# EAGLE design Nein (EAGLE 7.7.0)
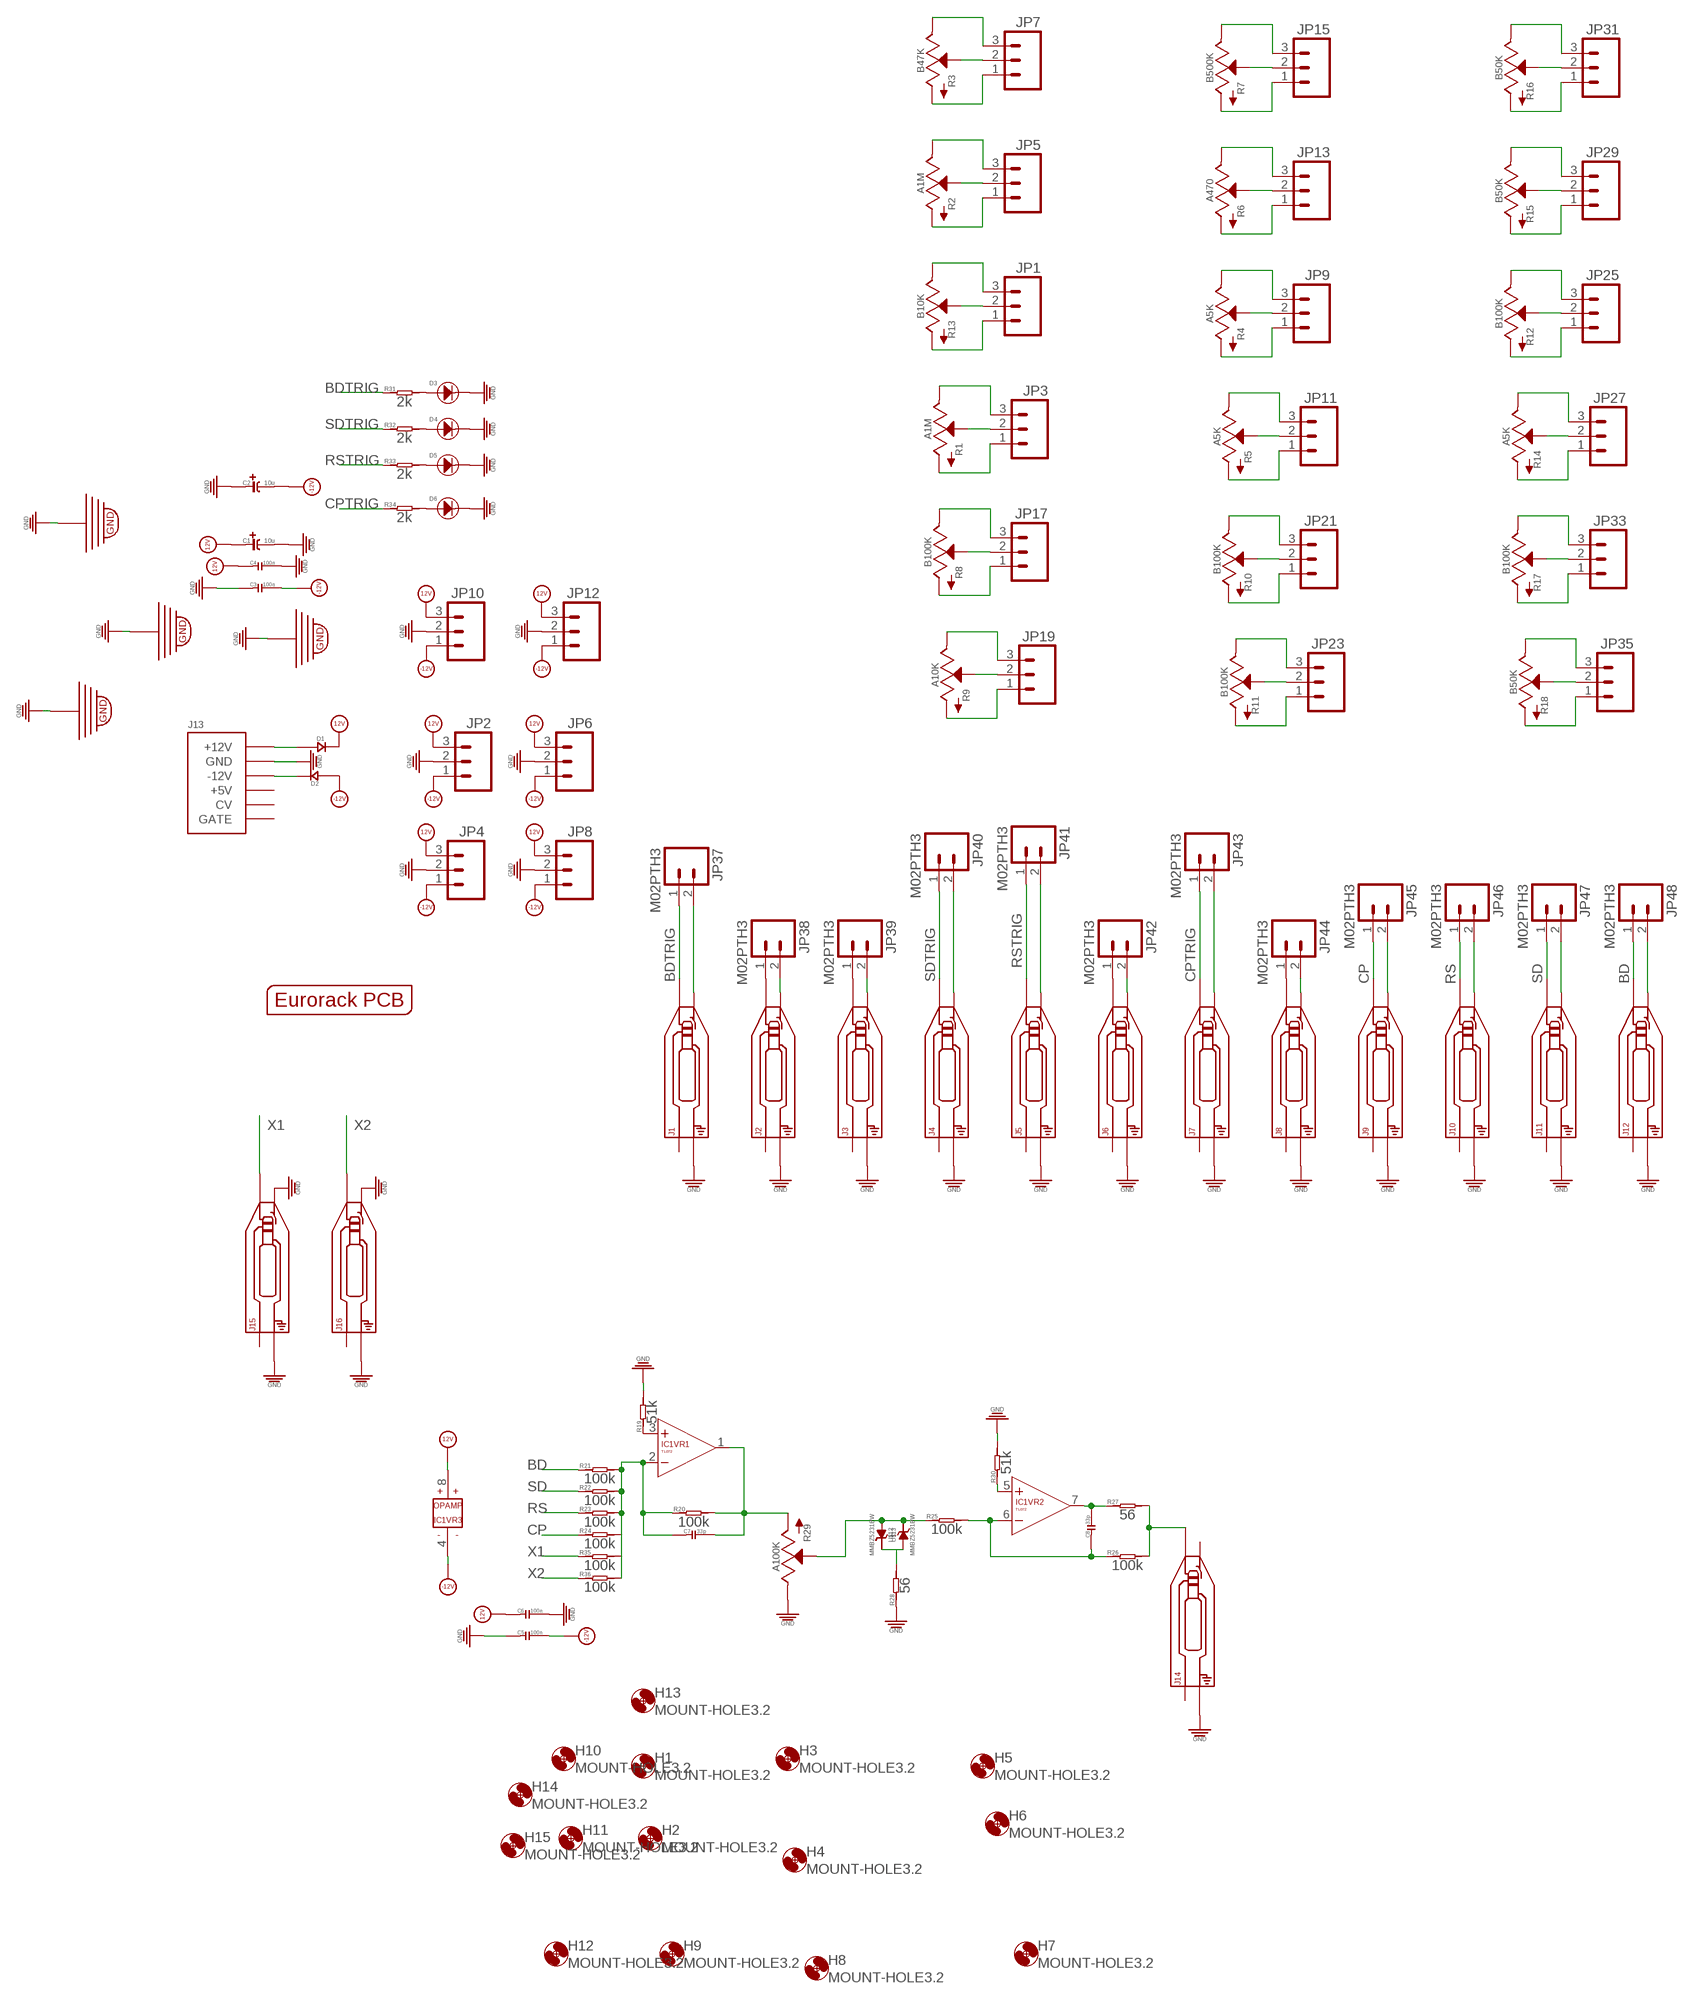
[diagram p0: schematic, sheet 1]

## Parts
C1  10u  C-POLAR-A  [CASE-A_3216]
C2  10u  C-POLAR-A  [CASE-A_3216]
C3  100n  C-0603  [C0603]
C4  100n  C-0603  [C0603]
C5  100n  C-0603  [C0603]
C6  100n  C-0603  [C0603]
C7  33p  C-0603  [C0603]
C8  33p  C-0603  [C0603]
D1  D-SMA  [DO-214AC]
D2  D-SMA  [DO-214AC]
D3  LED3MM  [3MMLED]
D4  LED3MM  [3MMLED]
D5  LED3MM  [3MMLED]
D6  LED3MM  [3MMLED]
H1  MOUNT-HOLE3.2  [3,2]
H2  MOUNT-HOLE3.2  [3,2]
H3  MOUNT-HOLE3.2  [3,2]
H4  MOUNT-HOLE3.2  [3,2]
H5  MOUNT-HOLE3.2  [3,2]
H6  MOUNT-HOLE3.2  [3,2]
H7  MOUNT-HOLE3.2  [3,2]
H8  MOUNT-HOLE3.2  [3,2]
H9  MOUNT-HOLE3.2  [3,2]
H10  MOUNT-HOLE3.2  [3,2]
H11  MOUNT-HOLE3.2  [3,2]
H12  MOUNT-HOLE3.2  [3,2]
H13  MOUNT-HOLE3.2  [3,2]
H14  MOUNT-HOLE3.2  [3,2]
H15  MOUNT-HOLE3.2  [3,2]
IC1  TL072  [SO08]
J1  AUDIO-JACK_SMALLSYMBOLNODRILL  [3.5MM-JACK-SWITCH-13MM-NOHOLES]
J2  AUDIO-JACK_SMALLSYMBOLNODRILL  [3.5MM-JACK-SWITCH-13MM-NOHOLES]
J3  AUDIO-JACK_SMALLSYMBOLNODRILL  [3.5MM-JACK-SWITCH-13MM-NOHOLES]
J4  AUDIO-JACK_SMALLSYMBOLNODRILL  [3.5MM-JACK-SWITCH-13MM-NOHOLES]
J5  AUDIO-JACK_SMALLSYMBOLNODRILL  [3.5MM-JACK-SWITCH-13MM-NOHOLES]
J6  AUDIO-JACK_SMALLSYMBOLNODRILL  [3.5MM-JACK-SWITCH-13MM-NOHOLES]
J7  AUDIO-JACK_SMALLSYMBOLNODRILL  [3.5MM-JACK-SWITCH-13MM-NOHOLES]
J8  AUDIO-JACK_SMALLSYMBOLNODRILL  [3.5MM-JACK-SWITCH-13MM-NOHOLES]
J9  AUDIO-JACK_SMALLSYMBOLNODRILL  [3.5MM-JACK-SWITCH-13MM-NOHOLES]
J10  AUDIO-JACK_SMALLSYMBOLNODRILL  [3.5MM-JACK-SWITCH-13MM-NOHOLES]
J11  AUDIO-JACK_SMALLSYMBOLNODRILL  [3.5MM-JACK-SWITCH-13MM-NOHOLES]
J12  AUDIO-JACK_SMALLSYMBOLNODRILL  [3.5MM-JACK-SWITCH-13MM-NOHOLES]
J13  POWERSHROUDED  [POWER_16_SHROUDED]
J14  AUDIO-JACK_SMALLSYMBOLNODRILL  [3.5MM-JACK-SWITCH-13MM-NOHOLES]
J15  AUDIO-JACK_SMALLSYMBOLNODRILL  [3.5MM-JACK-SWITCH-13MM-NOHOLES]
J16  AUDIO-JACK_SMALLSYMBOLNODRILL  [3.5MM-JACK-SWITCH-13MM-NOHOLES]
JP1  M03LONGPADS  [1X03_LONGPADS]
JP2  M03LONGPADS  [1X03_LONGPADS]
JP3  M03LONGPADS  [1X03_LONGPADS]
JP4  M03LONGPADS  [1X03_LONGPADS]
JP5  M03LONGPADS  [1X03_LONGPADS]
JP6  M03LONGPADS  [1X03_LONGPADS]
JP7  M03LONGPADS  [1X03_LONGPADS]
JP8  M03LONGPADS  [1X03_LONGPADS]
JP9  M03LONGPADS  [1X03_LONGPADS]
JP10  M03LONGPADS  [1X03_LONGPADS]
JP11  M03LONGPADS  [1X03_LONGPADS]
JP12  M03LONGPADS  [1X03_LONGPADS]
JP13  M03LONGPADS  [1X03_LONGPADS]
JP15  M03LONGPADS  [1X03_LONGPADS]
JP17  M03LONGPADS  [1X03_LONGPADS]
JP19  M03LONGPADS  [1X03_LONGPADS]
JP21  M03LONGPADS  [1X03_LONGPADS]
JP23  M03LONGPADS  [1X03_LONGPADS]
JP25  M03LONGPADS  [1X03_LONGPADS]
JP27  M03LONGPADS  [1X03_LONGPADS]
JP29  M03LONGPADS  [1X03_LONGPADS]
JP31  M03LONGPADS  [1X03_LONGPADS]
JP33  M03LONGPADS  [1X03_LONGPADS]
JP35  M03LONGPADS  [1X03_LONGPADS]
JP37  M02PTH3  [1X02_LONGPADS]
JP38  M02PTH3  [1X02_LONGPADS]
JP39  M02PTH3  [1X02_LONGPADS]
JP40  M02PTH3  [1X02_LONGPADS]
JP41  M02PTH3  [1X02_LONGPADS]
JP42  M02PTH3  [1X02_LONGPADS]
JP43  M02PTH3  [1X02_LONGPADS]
JP44  M02PTH3  [1X02_LONGPADS]
JP45  M02PTH3  [1X02_LONGPADS]
JP46  M02PTH3  [1X02_LONGPADS]
JP47  M02PTH3  [1X02_LONGPADS]
JP48  M02PTH3  [1X02_LONGPADS]
PCB1  EURORACK_PCB36HP_10CM  [EURORACK36HP]
R1  A1M  POTSQUAREHOLE_SMALLKNOB  [ALPS_POT_SQUAREHOLES]
R2  A1M  POTSQUAREHOLE_SMALLKNOB  [ALPS_POT_SQUAREHOLES]
R3  B47K  POTSQUAREHOLE_SMALLKNOB  [ALPS_POT_SQUAREHOLES]
R4  A5K  POTSQUAREHOLE_SMALLKNOB  [ALPS_POT_SQUAREHOLES]
R5  A5K  POTSQUAREHOLE_SMALLKNOB  [ALPS_POT_SQUAREHOLES]
R6  A470  POTSQUAREHOLE_SMALLKNOB  [ALPS_POT_SQUAREHOLES]
R7  B500K  POTSQUAREHOLE_SMALLKNOB  [ALPS_POT_SQUAREHOLES]
R8  B100K  POTSQUAREHOLE_SMALLKNOB  [ALPS_POT_SQUAREHOLES]
R9  A10K  POTSQUAREHOLE_SMALLKNOB  [ALPS_POT_SQUAREHOLES]
R10  B100K  POTSQUAREHOLE_SMALLKNOB  [ALPS_POT_SQUAREHOLES]
R11  B100K  POTSQUAREHOLE_SMALLKNOB  [ALPS_POT_SQUAREHOLES]
R12  B100K  POTSQUAREHOLE_SMALLKNOB  [ALPS_POT_SQUAREHOLES]
R13  B10K  POTSQUAREHOLE_SMALLKNOB  [ALPS_POT_SQUAREHOLES]
R14  A5K  POTSQUAREHOLE_SMALLKNOB  [ALPS_POT_SQUAREHOLES]
R15  B50K  POTSQUAREHOLE_SMALLKNOB  [ALPS_POT_SQUAREHOLES]
R16  B50K  POTSQUAREHOLE_SMALLKNOB  [ALPS_POT_SQUAREHOLES]
R17  B100K  POTSQUAREHOLE_SMALLKNOB  [ALPS_POT_SQUAREHOLES]
R18  B50K  POTSQUAREHOLE_SMALLKNOB  [ALPS_POT_SQUAREHOLES]
R19  51k  R-0603  [R0603]
R20  100k  R-0603  [R0603]
R21  100k  R-0603  [R0603]
R22  100k  R-0603  [R0603]
R23  100k  R-0603  [R0603]
R24  100k  R-0603  [R0603]
R25  100k  R-0603  [R0603]
R26  100k  R-0603  [R0603]
R27  56  R-0603  [R0603]
R28  56  R-0603  [R0603]
R29  A100K  POTSQUAREHOLE_SMALLKNOB  [ALPS_POT_SQUAREHOLES]
R30  51k  R-0603  [R0603]
R31  2k  R-0603  [R0603]
R32  2k  R-0603  [R0603]
R33  2k  R-0603  [R0603]
R34  2k  R-0603  [R0603]
R35  100k  R-0603  [R0603]
R36  100k  R-0603  [R0603]
U$4  GNDLOOP  [GROUNDLOOP]
U$12  MMBZ5231BW  [SOT-323-ZENER]
U$13  MMBZ5231BW  [SOT-323-ZENER]
U$26  GNDLOOP  [GROUNDLOOP]
U$27  GNDLOOP  [GROUNDLOOP]
U$28  GNDLOOP  [GROUNDLOOP]

## Nets
12V [power]: C1.+ C4.1 C6.1 D1.2(-) IC1.8(VR3:V+) JP2.3 JP4.3 JP6.3 JP8.3 JP10.3 JP12.3
-12V [power]: C2.- C3.2 C5.2 D2.1(+) IC1.4(VR3:V-) JP2.1 JP4.1 JP6.1 JP8.1 JP10.1 JP12.1
BD: J12.TIP_B@1(TIP) J12.TIP_T@3(TIP) JP48.1 R21.1
BDTRIG: J1.TIP_B@1(TIP) J1.TIP_T@3(TIP) JP37.1 R31.1
CP: J9.TIP_B@1(TIP) J9.TIP_T@3(TIP) JP45.1 R24.1
CPTRIG: J7.TIP_B@1(TIP) J7.TIP_T@3(TIP) JP43.1 R34.1
GND [power]: C1.- C2.+ C3.1 C4.2 C5.1 C6.2 D3.- D4.- D5.- D6.- J1.RING_B@1(RING) J1.RING_T@3(RING) J2.RING_B@1(RING) J2.RING_T@3(RING) J3.RING_B@1(RING) J3.RING_T@3(RING) J4.RING_B@1(RING) J4.RING_T@3(RING) J5.RING_B@1(RING) J5.RING_T@3(RING) J6.RING_B@1(RING) J6.RING_T@3(RING) J7.RING_B@1(RING) J7.RING_T@3(RING) J8.RING_B@1(RING) J8.RING_T@3(RING) J9.RING_B@1(RING) J9.RING_T@3(RING) J10.RING_B@1(RING) J10.RING_T@3(RING) J11.RING_B@1(RING) J11.RING_T@3(RING) J12.RING_B@1(RING) J12.RING_T@3(RING) J13.3(GND) J13.4(GND) J13.5(GND) J13.6(GND) J13.7(GND) J13.8(GND) J14.RING_B@1(RING) J14.RING_T@3(RING) J15.RING_B@1(RING) J15.RING_T@3(RING) J15.SWITCH_B@1(SWITCH) J15.SWITCH_T@3(SWITCH) J16.RING_B@1(RING) J16.RING_T@3(RING) J16.SWITCH_B@1(SWITCH) J16.SWITCH_T@3(SWITCH) JP2.2 JP4.2 JP6.2 JP8.2 JP10.2 JP12.2 R19.2 R28.1 R29.P$1(E) R30.2 U$4.P$1 U$4.P$2 U$26.P$1 U$26.P$2 U$27.P$1 U$27.P$2 U$28.P$1 U$28.P$2
N$1 [power]: D1.1(+) J13.9(+12V) J13.10(+12V)
N$2 [power]: D2.2(-) J13.1(-12V) J13.2(-12V)
N$3: JP1.2 R13.P$2(S)
N$4: JP1.3 R13.P$1(E)
N$5: JP1.1 R13.P$3(A)
N$6: JP3.2 R1.P$2(S)
N$7: JP3.3 R1.P$1(E)
N$8: JP3.1 R1.P$3(A)
N$9: JP5.2 R2.P$2(S)
N$10: JP5.3 R2.P$1(E)
N$11: JP5.1 R2.P$3(A)
N$12: JP7.2 R3.P$2(S)
N$13: JP7.3 R3.P$1(E)
N$14: JP7.1 R3.P$3(A)
N$15: JP9.2 R4.P$2(S)
N$16: JP9.3 R4.P$1(E)
N$17: JP9.1 R4.P$3(A)
N$18: JP11.2 R5.P$2(S)
N$19: JP11.3 R5.P$1(E)
N$20: JP11.1 R5.P$3(A)
N$21: JP13.2 R6.P$2(S)
N$22: JP13.3 R6.P$1(E)
N$23: JP13.1 R6.P$3(A)
N$24: JP15.2 R7.P$2(S)
N$25: JP15.3 R7.P$1(E)
N$26: JP15.1 R7.P$3(A)
N$27: JP17.2 R8.P$2(S)
N$28: JP17.3 R8.P$1(E)
N$29: JP17.1 R8.P$3(A)
N$30: JP19.2 R9.P$2(S)
N$31: JP19.3 R9.P$1(E)
N$32: JP19.1 R9.P$3(A)
N$33: JP21.2 R10.P$2(S)
N$34: JP21.3 R10.P$1(E)
N$35: JP21.1 R10.P$3(A)
N$36: JP23.2 R11.P$2(S)
N$37: JP23.3 R11.P$1(E)
N$38: JP23.1 R11.P$3(A)
N$39: JP25.2 R12.P$2(S)
N$40: JP25.3 R12.P$1(E)
N$41: JP25.1 R12.P$3(A)
N$42: JP27.2 R14.P$2(S)
N$43: JP27.3 R14.P$1(E)
N$44: JP27.1 R14.P$3(A)
N$45: JP29.2 R15.P$2(S)
N$46: JP29.3 R15.P$1(E)
N$47: JP29.1 R15.P$3(A)
N$48: JP31.2 R16.P$2(S)
N$49: JP31.3 R16.P$1(E)
N$50: JP31.1 R16.P$3(A)
N$51: JP33.2 R17.P$2(S)
N$52: JP33.3 R17.P$1(E)
N$53: JP33.1 R17.P$3(A)
N$54: JP35.2 R18.P$2(S)
N$55: JP35.3 R18.P$1(E)
N$56: JP35.1 R18.P$3(A)
N$58: J1.SWITCH_B@1(SWITCH) J1.SWITCH_T@3(SWITCH) JP37.2
N$59: J2.TIP_B@1(TIP) J2.TIP_T@3(TIP) JP38.1
N$60: J2.SWITCH_B@1(SWITCH) J2.SWITCH_T@3(SWITCH) JP38.2
N$61: J3.TIP_B@1(TIP) J3.TIP_T@3(TIP) JP39.1
N$62: J3.SWITCH_B@1(SWITCH) J3.SWITCH_T@3(SWITCH) JP39.2
N$64: J4.SWITCH_B@1(SWITCH) J4.SWITCH_T@3(SWITCH) JP40.2
N$66: J5.SWITCH_B@1(SWITCH) J5.SWITCH_T@3(SWITCH) JP41.2
N$67: J6.TIP_B@1(TIP) J6.TIP_T@3(TIP) JP42.1
N$68: J6.SWITCH_B@1(SWITCH) J6.SWITCH_T@3(SWITCH) JP42.2
N$70: J7.SWITCH_B@1(SWITCH) J7.SWITCH_T@3(SWITCH) JP43.2
N$71: J8.TIP_B@1(TIP) J8.TIP_T@3(TIP) JP44.1
N$72: J8.SWITCH_B@1(SWITCH) J8.SWITCH_T@3(SWITCH) JP44.2
N$73: IC1.3(VR1:+IN) R19.1
N$74: J9.SWITCH_B@1(SWITCH) J9.SWITCH_T@3(SWITCH) JP45.2
N$75: IC1.5(VR2:+IN) R30.1
N$76: J10.SWITCH_B@1(SWITCH) J10.SWITCH_T@3(SWITCH) JP46.2
N$77: D3.+ R31.2
N$78: J11.SWITCH_B@1(SWITCH) J11.SWITCH_T@3(SWITCH) JP47.2
N$79: D4.+ R32.2
N$80: J12.SWITCH_B@1(SWITCH) J12.SWITCH_T@3(SWITCH) JP48.2
N$81: D5.+ R33.2
N$82: D6.+ R34.2
N$84: C7.1 IC1.2(VR1:-IN) R20.1 R21.2 R22.2 R23.2 R24.2 R35.2 R36.2
N$85: R28.2 U$12.CATHODE U$13.ANODE
N$86: C7.2 IC1.1(VR1:OUT) R20.2 R29.P$3(A)
N$87: C8.1 IC1.6(VR2:-IN) R25.2 R26.1
N$88: C8.2 IC1.7(VR2:OUT) R27.1
N$89: J14.TIP_B@1(TIP) J14.TIP_T@3(TIP) R26.2 R27.2
N$90: R25.1 R29.P$2(S) U$12.ANODE U$13.CATHODE
RS: J10.TIP_B@1(TIP) J10.TIP_T@3(TIP) JP46.1 R23.1
RSTRIG: J5.TIP_B@1(TIP) J5.TIP_T@3(TIP) JP41.1 R33.1
SD: J11.TIP_B@1(TIP) J11.TIP_T@3(TIP) JP47.1 R22.1
SDTRIG: J4.TIP_B@1(TIP) J4.TIP_T@3(TIP) JP40.1 R32.1
X1: J15.TIP_B@1(TIP) J15.TIP_T@3(TIP) R35.1
X2: J16.TIP_B@1(TIP) J16.TIP_T@3(TIP) R36.1
Unconnected: J1.SECOND_B@1(SECOND) J1.SECOND_T@3(SECOND) J2.SECOND_B@1(SECOND) J2.SECOND_T@3(SECOND) J3.SECOND_B@1(SECOND) J3.SECOND_T@3(SECOND) J4.SECOND_B@1(SECOND) J4.SECOND_T@3(SECOND) J5.SECOND_B@1(SECOND) J5.SECOND_T@3(SECOND) J6.SECOND_B@1(SECOND) J6.SECOND_T@3(SECOND) J7.SECOND_B@1(SECOND) J7.SECOND_T@3(SECOND) J8.SECOND_B@1(SECOND) J8.SECOND_T@3(SECOND) J9.SECOND_B@1(SECOND) J9.SECOND_T@3(SECOND) J10.SECOND_B@1(SECOND) J10.SECOND_T@3(SECOND) J11.SECOND_B@1(SECOND) J11.SECOND_T@3(SECOND) J12.SECOND_B@1(SECOND) J12.SECOND_T@3(SECOND) J13.11(+5V) J13.12(+5V) J13.13(CV) J13.14(CV) J13.15(GATE) J13.16(GATE) J14.SECOND_B@1(SECOND) J14.SECOND_T@3(SECOND) J14.SWITCH_B@1(SWITCH) J14.SWITCH_T@3(SWITCH) J15.SECOND_B@1(SECOND) J15.SECOND_T@3(SECOND) J16.SECOND_B@1(SECOND) J16.SECOND_T@3(SECOND)

## Library data of the parts
C1 C2 = EurorackModularParts:C-POLAR*
C3-C8 = OPL:C*
D1 D2 = OPL:D*: DIODE
D3-D6 = EurorackModularParts:LED*: LED
H1-H15 = zephod-components:MOUNT-HOLE: MOUNTING HOLE with drill center marker
IC1 = EurorackModularParts:TL072
J1 = EurorackModularParts:AUDIO-JACK_SMALLSYMBOL: Switching Mono 3.5mm Audio Jack from Erthenvar.; DESC: BD Trig
J2 = EurorackModularParts:AUDIO-JACK_SMALLSYMBOL: Switching Mono 3.5mm Audio Jack from Erthenvar.; DESC: BD Acc
J3 = EurorackModularParts:AUDIO-JACK_SMALLSYMBOL: Switching Mono 3.5mm Audio Jack from Erthenvar.; DESC: SD Acc
J4 = EurorackModularParts:AUDIO-JACK_SMALLSYMBOL: Switching Mono 3.5mm Audio Jack from Erthenvar.; DESC: SD Trig
J5 = EurorackModularParts:AUDIO-JACK_SMALLSYMBOL: Switching Mono 3.5mm Audio Jack from Erthenvar.; DESC: RS Trig
J6 = EurorackModularParts:AUDIO-JACK_SMALLSYMBOL: Switching Mono 3.5mm Audio Jack from Erthenvar.; DESC: RS Acc
J7 = EurorackModularParts:AUDIO-JACK_SMALLSYMBOL: Switching Mono 3.5mm Audio Jack from Erthenvar.; DESC: CP Trig
J8 = EurorackModularParts:AUDIO-JACK_SMALLSYMBOL: Switching Mono 3.5mm Audio Jack from Erthenvar.; DESC: CP Acc
J9 = EurorackModularParts:AUDIO-JACK_SMALLSYMBOL: Switching Mono 3.5mm Audio Jack from Erthenvar.; DESC: CP Out
J10 = EurorackModularParts:AUDIO-JACK_SMALLSYMBOL: Switching Mono 3.5mm Audio Jack from Erthenvar.; DESC: RS Out
J11 = EurorackModularParts:AUDIO-JACK_SMALLSYMBOL: Switching Mono 3.5mm Audio Jack from Erthenvar.; DESC: SD Out
J12 = EurorackModularParts:AUDIO-JACK_SMALLSYMBOL: Switching Mono 3.5mm Audio Jack from Erthenvar.; DESC: BD Out
J13 = EurorackModularParts:POWER
J14 = EurorackModularParts:AUDIO-JACK_SMALLSYMBOL: Switching Mono 3.5mm Audio Jack from Erthenvar.; DESC: Mix Out
J15 = EurorackModularParts:AUDIO-JACK_SMALLSYMBOL: Switching Mono 3.5mm Audio Jack from Erthenvar.; DESC: Mix 1
J16 = EurorackModularParts:AUDIO-JACK_SMALLSYMBOL: Switching Mono 3.5mm Audio Jack from Erthenvar.; DESC: Mix 2
JP1-JP13 JP15 JP17 JP19 JP21 JP23 JP25 JP27 JP29 JP31 JP33 JP35 = SparkFun-Connectors:M03: Header 3 Standard 3-pin 0.1" header. Use with straight break away headers (SKU : PRT-00116), right angle break away headers (PRT-00553), swiss pins (PRT-00743), machine pins (PRT-00117), and female headers (PRT-00115). Molex polarized connector foot print use with SKU : PRT-08232 with associated crimp pins and housings.
JP37-JP48 = SparkFun-Connectors:M02: Standard 2-pin 0.1" header. Use with - straight break away headers ( PRT-00116) - right angle break away headers (PRT-00553) - swiss pins (PRT-00743) - machine pins (PRT-00117) - female headers (PRT-00115) Molex polarized connector foot print use with: PRT-08233 with associated crimp pins and housings. 2.54_SCREWTERM for use with PRT-10571. 3.5mm Screw Terminal footprints for PRT-08084 5mm Screw Terminal footprints for use with PRT-08433
PCB1 = EurorackModularParts:EURORACK_PCB
R1 = EurorackModularParts:POT; DESC: BD Decay
R2 = EurorackModularParts:POT; DESC: BD Tune Decay
R3 = EurorackModularParts:POT; DESC: BD Pitch
R4 = EurorackModularParts:POT; DESC: RS Tune 2
R5 = EurorackModularParts:POT; DESC: RS Tune 1
R6 = EurorackModularParts:POT; DESC: BD Attack
R7 = EurorackModularParts:POT; DESC: SD Tune 2
R8 = EurorackModularParts:POT; DESC: CP Noise 1
R9 = EurorackModularParts:POT; DESC: BD Distort
R10 = EurorackModularParts:POT; DESC: SD Snap
R11 = EurorackModularParts:POT; DESC: CP Noise 2
R12 = EurorackModularParts:POT; DESC: RS Level
R13 = EurorackModularParts:POT; DESC: SD Tune 1
R14 = EurorackModularParts:POT; DESC: RS Tune 3
R15 = EurorackModularParts:POT; DESC: CP Level
R16 = EurorackModularParts:POT; DESC: SD Level
R17 = EurorackModularParts:POT; DESC: BD Level
R18 = EurorackModularParts:POT; DESC: CP Intensity
R19-R28 R30-R36 = OPL:R*
R29 = EurorackModularParts:POT; DESC: Mix Level
U$4 U$26-U$28 = FenixBase:GNDLOOP
U$12 U$13 = FenixBase:MMBZ5231BW: 5.1V ZENER DIODE - SMD

## Net classes
0 default: width 0.254 mm
1 power: width 0.635 mm

## Board
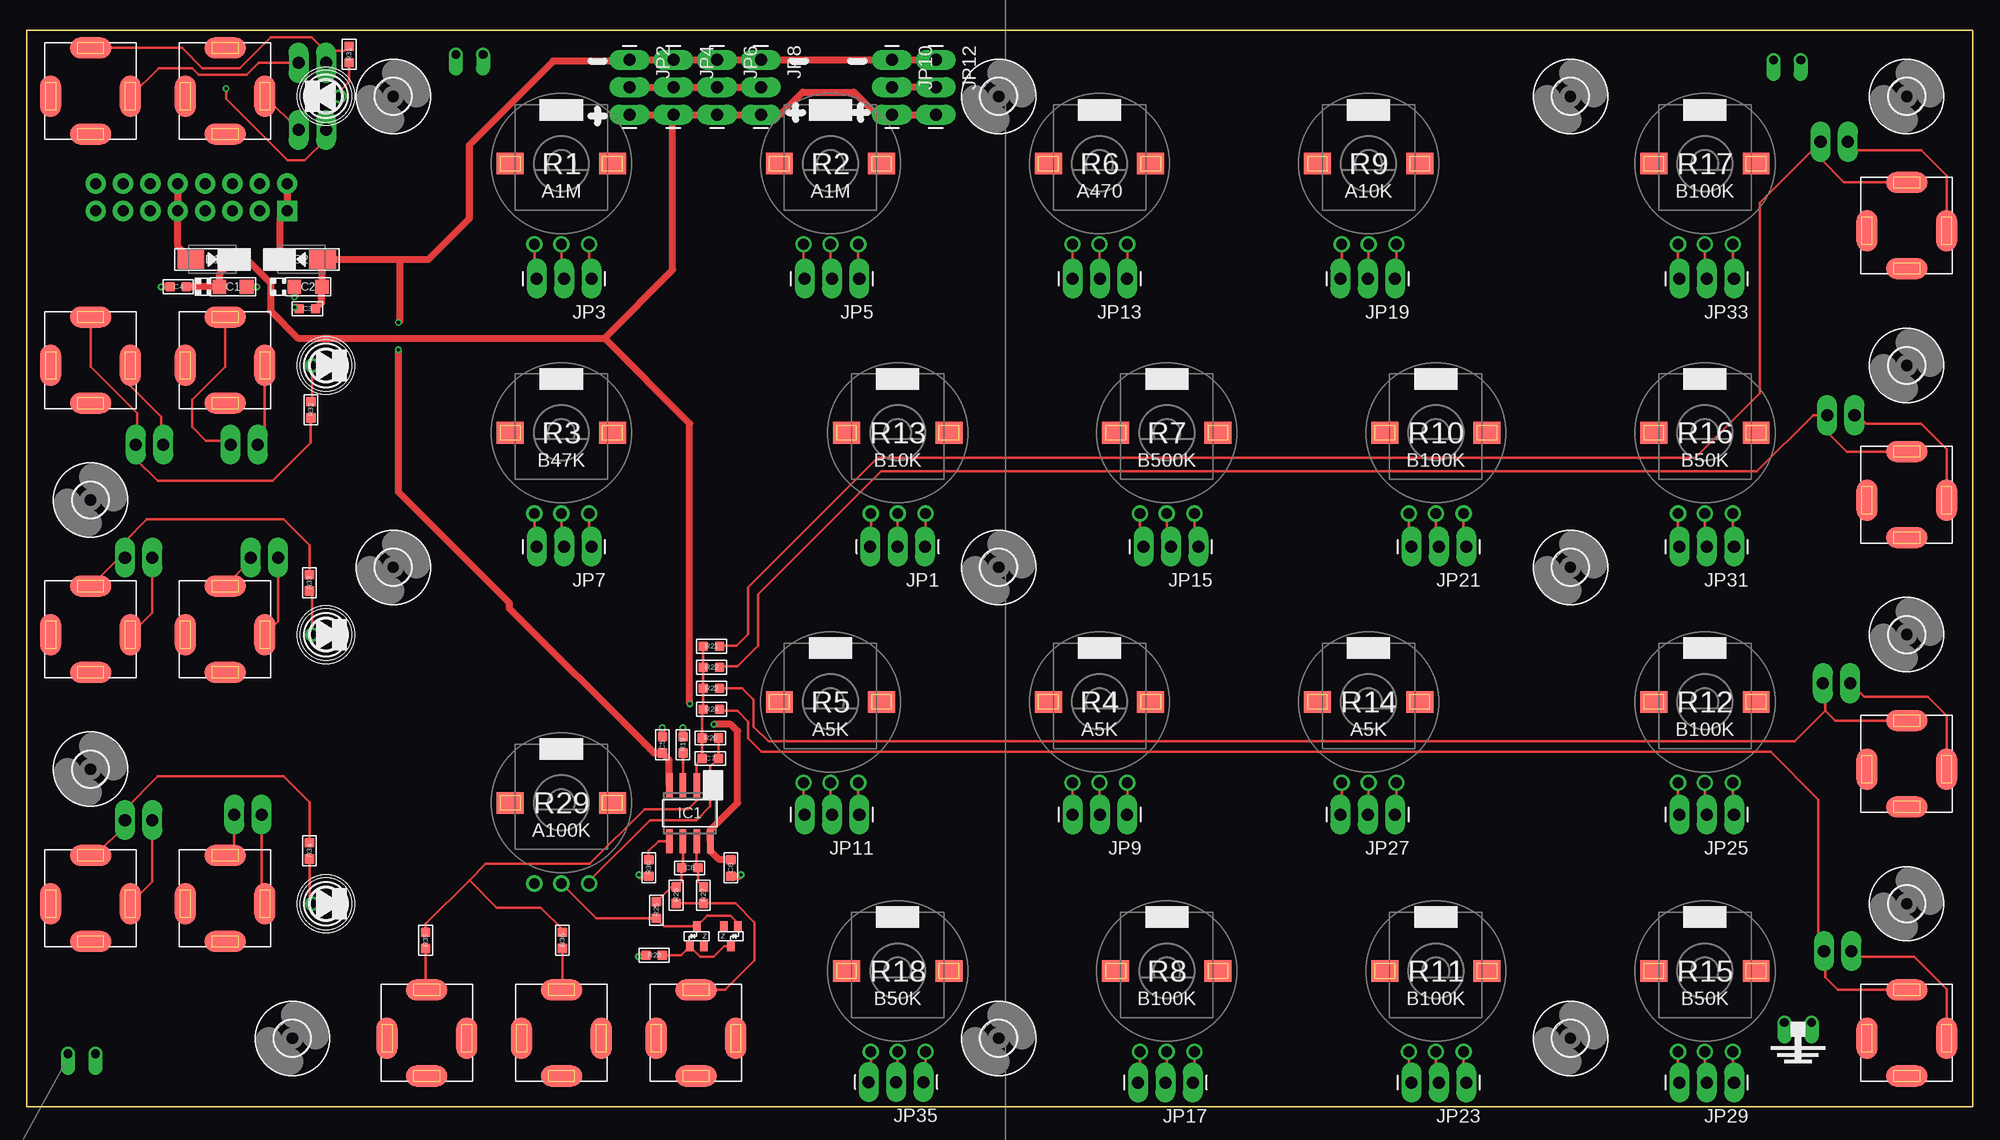
[diagram p1: board, top side]
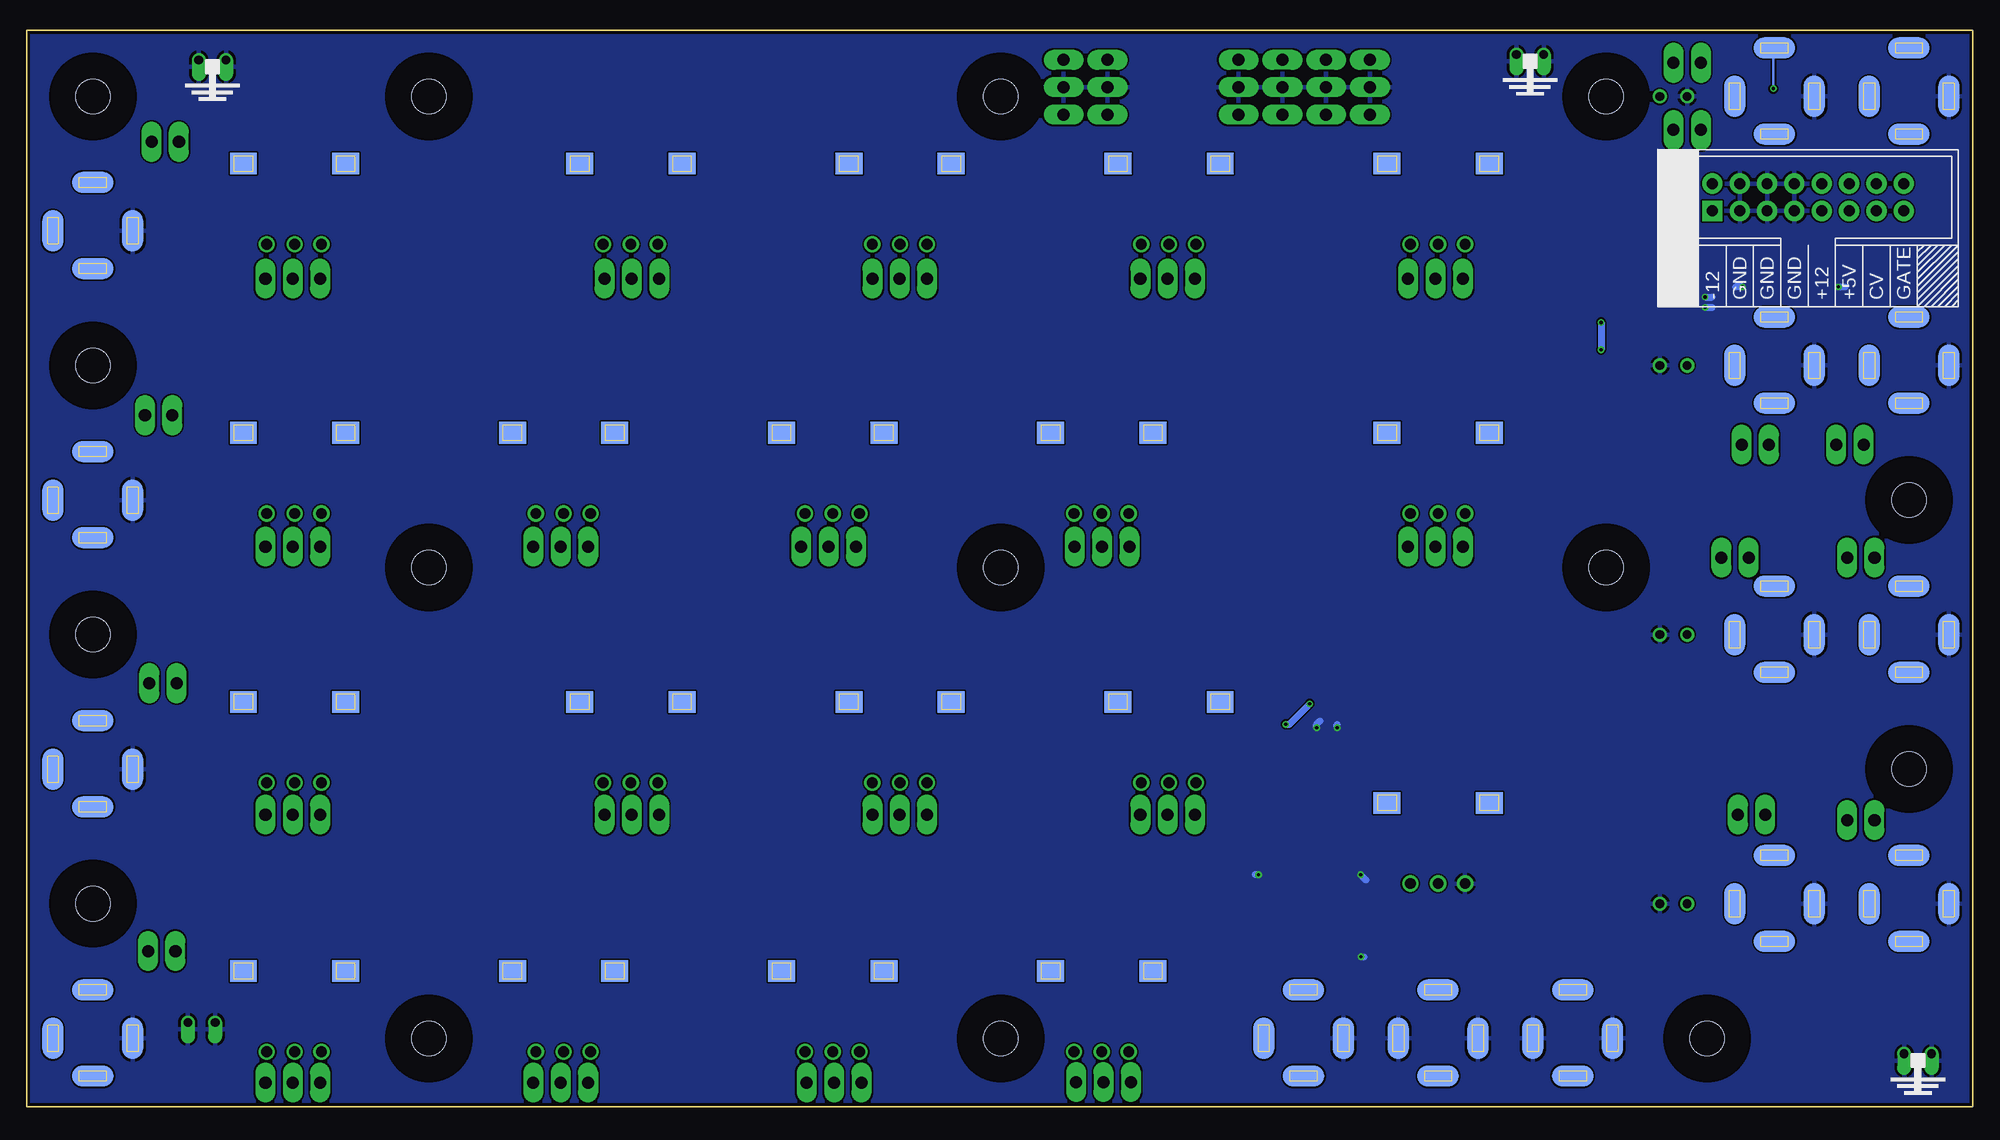
[diagram p2: board, bottom side, seen from below]

Size 180.78 x 100 mm. Coordinates in mm from the lower left corner, seen from the top.
Copper layers (1*16): Top 0.035mm / dielectric 1.5mm / Bottom 0.035mm
Design rules "ITEADstudio_DRC": minimum track width 6mil, minimum drill 12mil, track to track 6mil, track to pad 6mil, pad to pad 6mil, via to via 6mil, smd to smd 0mil, copper to edge 10mil, drill to drill 10mil, minimum pad ring 10mil, minimum via ring 6mil, stop-mask expansion 2mil, vias tented up to drill 100mil, thermal gap 10mil

### Footprints (pad centres in the part's own frame; a part is rotated, then mirrored left to right if it is on the bottom)
CASE-A_3216 = smd 1.27 x 1.27: + -1.27,0; - 1.27,0
C0603 = smd 0.889 x 0.889: 1 -0.762,0; 2 0.762,0
DO-214AC = smd 2.5 x 1.7: 1 -2,0; 2 2,0
3MMLED = drill 0.8: + -1.27,0; - 1.27,0
3,2 = hole 3.2: 0,0
SO08 = smd 0.6 x 2.2: 1 -1.905,-2.6; 2 -0.635,-2.6; 3 0.635,-2.6; 4 1.905,-2.6; 5 1.905,2.6; 6 0.635,2.6; 7 -0.635,2.6; 8 -1.905,2.6
3.5MM-JACK-SWITCH-13MM-NOHOLES = smd 1.95 x 3.85 bottom: RING_B@1 -3.7,0; SWITCH_B@1 3.7,0 | smd 1.95 x 3.85: RING_T@3 -3.7,0; SWITCH_T@3 3.7,0 | smd 3.85 x 1.95 bottom: SECOND_B@1 0,-3.5; TIP_B@1 0,4.5 | smd 3.85 x 1.95: SECOND_T@3 0,-3.5; TIP_T@3 0,4.5
POWER_16_SHROUDED = drill 1.016 pad 1.88 square: 1 -8.89,-1.27 | drill 1.016 pad 1.88: 2 -8.89,1.27; 3 -6.35,-1.27; 4 -6.35,1.27; 5 -3.81,-1.27; 6 -3.81,1.27; 7 -1.27,-1.27; 8 -1.27,1.27; 9 1.27,-1.27; 10 1.27,1.27; 11 3.81,-1.27; 12 3.81,1.27; 13 6.35,-1.27; 14 6.35,1.27; 15 8.89,-1.27; 16 8.89,1.27
1X03_LONGPADS = drill 1.118 pad 1.88 long: 1 0,0; 2 2.54,0; 3 5.08,0
1X02_LONGPADS = drill 1.118 pad 1.88 long: 1 0,0; 2 2.54,0
ALPS_POT_SQUAREHOLES = drill 1: P$1 -2.5,-7.5; P$2 0,-7.5; P$3 2.58,-7.5 | smd 2.5 x 2: P$4 -4.75,0; P$5 4.75,0 | smd 2.5 x 2 bottom: P$6 -4.75,0; P$7 4.75,0
R0603 = smd 0.889 x 0.889: 1 -0.762,0; 2 0.762,0
GROUNDLOOP = drill 0.8 offset: P$1 1.27,0; P$2 -1.27,0
SOT-323-ZENER = smd 0.7 x 0.9: ANODE -0.65,-0.95; CATHODE 0,0.95; NC 0.65,-0.95

### Placement (x,y rotation side)
C1  19.14,76.18 0 top
C2  26.13,76.18 0 top
C3  26.06,74.15 0 top
C4  14.06,76.18 180 top
C5  59.05,33.64 270 top
C6  65.4,22.2 270 top
C7  63.5,32.36 0 top
C8  61.59,22.2 0 top
D1  17.24,78.72 0 top
D2  25.5,78.72 180 top
D3  27.79,93.88 180 top
D4  27.79,68.88 0 top
D5  27.79,43.88 0 top
D6  27.79,18.88 0 top
H1  90.28,93.88 0 top
H2  90.28,6.38 0 top
H3  90.28,50.12 0 top
H4  143.41,93.88 0 top
H5  143.41,50.12 0 top
H6  143.41,6.38 0 top
H7  34.03,93.88 0 top
H8  24.66,6.38 0 top
H9  34.03,50.12 0 top
H10  174.66,18.88 0 top
H11  174.66,43.88 0 top
H12  174.66,93.88 0 top
H13  174.66,68.88 0 top
H14  5.91,56.38 0 top
H15  5.91,31.38 0 top
IC1  61.59,27.28 180 top
J1  5.91,93.88 0 top
J2  18.41,93.88 0 top
J3  18.41,68.88 0 top
J4  5.91,68.88 0 top
J5  5.91,43.88 0 top
J6  18.41,43.88 0 top
J7  5.91,18.88 0 top
J8  18.41,18.88 0 top
J9  174.66,6.38 0 top
J10  174.66,31.38 0 top
J11  174.66,56.38 0 top
J12  174.66,81.38 0 top
J13  15.29,84.5 0 bottom
J14  62.16,6.38 0 top
J15  37.16,6.38 0 top
J16  49.66,6.38 0 top
JP1  83.43,52.05 180 top
JP2  56,97.26 270 top
JP3  52.45,76.94 180 top
JP4  60.07,97.26 270 top
JP5  77.34,76.94 180 top
JP6  64.13,97.26 270 top
JP7  52.45,52.05 180 top
JP8  68.19,97.26 270 top
JP9  102.23,27.16 180 top
JP10  80.39,97.26 270 top
JP11  77.34,27.16 180 top
JP12  84.45,97.26 270 top
JP13  102.23,76.94 180 top
JP15  108.83,52.05 180 top
JP17  108.33,2.27 180 top
JP19  127.12,76.94 180 top
JP21  133.73,52.05 180 top
JP23  133.73,2.27 180 top
JP25  158.62,27.16 180 top
JP27  127.12,27.16 180 top
JP29  158.62,2.27 180 top
JP31  158.62,52.05 180 top
JP33  158.62,76.94 180 top
JP35  83.3,2.31 180 top
JP37  27.79,97 180 top
JP38  27.79,90.75 180 top
JP39  18.92,61.53 0 top
JP40  10.13,61.53 0 top
JP41  9.11,51.03 0 top
JP42  20.8,51.03 0 top
JP43  9.11,26.65 0 top
JP44  19.27,27.16 0 top
JP45  166.98,14.47 0 top
JP46  166.87,39.37 0 top
JP47  167.27,64.26 0 top
JP48  166.65,89.66 0 top
PCB1  -0.34,-3 0 top
R1  49.66,87.62 0 top
R2  74.66,87.62 0 top
R3  49.66,62.62 0 top
R4  99.66,37.62 0 top
R5  74.66,37.62 0 top
R6  99.66,87.62 0 top
R7  105.91,62.62 0 top
R8  105.91,12.62 0 top
R9  124.66,87.62 0 top
R10  130.91,62.62 0 top
R11  130.91,12.62 0 top
R12  155.91,37.62 0 top
R13  80.91,62.62 0 top
R14  124.66,37.62 0 top
R15  155.91,12.62 0 top
R16  155.91,62.62 0 top
R17  155.91,87.62 0 top
R18  80.91,12.62 0 top
R19  60.95,33.64 90 top
R20  63.5,34.27 0 top
R21  63.6,42.8 180 top
R22  63.6,40.84 180 top
R23  63.6,38.89 180 top
R24  63.6,36.94 180 top
R25  58.49,18.29 90 top
R26  60.32,19.67 270 top
R27  62.86,19.67 270 top
R28  58.28,14.09 0 top
R29  49.66,28.25 0 top
R30  57.78,22.2 270 top
R31  29.94,97.77 270 top
R32  26.38,64.75 90 top
R33  26.26,48.68 270 top
R34  26.26,23.79 270 top
R35  37.05,15.47 90 top
R36  49.75,15.47 90 top
U$4  5.08,4.94 0 bottom
U$12  65.4,15.86 180 top
U$13  62.22,15.86 0 top
U$26  41.12,97.77 0 bottom
U$27  163.54,97.26 0 bottom
U$28  164.56,7.85 0 top

### Tracks (layer width: path | path; a pad name or v marks a point on that pad's centre or on a via)
12V  (via drill 0.3)
  Top 0.635: C4.1 C1.+ 17.88,77.35 D1.2 20.41,78.72 22.64,76.5 22.64,73.96 25.18,71.42 53.65,71.42 | JP2.3 JP4.3 | JP4.3 JP6.3 JP8.3 69.97,92.18 72.07,94.28 76.83,94.28 79.05,92.06 80.26,92.06 JP10.3 JP12.3 | C6.1 64.32,22.97 63.5,23.79 IC1.8 63.5,25.7 66.03,28.24 66.03,34.91 65.4,35.54 v63.81,35.54 | 53.65,71.42 60,77.77 60,92.12 JP4.3 | v61.59,37.44 61.59,63.48 53.65,71.42
  Bottom 0.635: v63.81,35.54 63.5,35.54 v61.59,37.44
-12V  (via drill 0.3)
  Top 0.635: C3.2 27.4,74.72 C2.- 27.4,78.62 D2.1 34.65,78.72 | JP12.1 JP10.1 JP8.1 JP6.1 JP4.1 JP2.1 55.88,97.14 48.89,97.14 41.12,89.36 41.12,82.53 37.31,78.72 34.65,78.72 | IC1.4 59.69,32.24 C5.2 | 58.92,33 C5.2 | 34.65,78.72 34.65,73.01 v34.51,72.88 | v34.51,70.34 34.51,57.13 44.83,46.82 44.83,46.31 57.37,33.76 57.88,33.25 58.26,32.87 C5.2
  Bottom 0.635: v34.51,72.88 v34.51,70.34
BD
  Top 0.254: 67.02,48.28 79.05,60.31 155.03,60.31 161,66.27 161,84.01 JP48.1 166.65,88.06 168.84,85.88 J12.TIP_B@1 | 67.02,48.28 66.99,48.24 | R21.1 64.41,42.84 65.94,42.84 67.02,43.92 67.02,48.28
BDTRIG
  Top 0.254: JP37.1 27.72,97.07 27.72,98.09 | 27.72,98.09 26.45,99.36 22.64,99.36 19.78,96.5 16.29,96.5 14.41,98.38 J1.TIP_B@1 | 27.72,98.09 29.5,98.09 R31.1
CP
  Top 0.254: R24.1 64.49,36.81 66.01,36.81 67.02,35.79 67.02,34.23 68.26,33 162.02,33 166.47,28.56 166.47,14.99 JP45.1 166.87,14.58 166.47,14.58 167.1,13.95 167.1,12.05 168.27,10.88 J9.TIP_B@1
CPTRIG
  Top 0.254: J7.TIP_B@1 6.01,23.47 6.45,23.47 9.11,26.14 JP43.1 9.11,27.67 12.16,30.71 23.84,30.71 26.26,28.3 R34.1
GND  (via drill 0.3)
  Top 0.635: C1.- v21.37,76.18 | C2.+ v24.86,75.23 | C3.1 25.18,74.28 v24.86,74.28 | C4.2 v12.48,76.18 | JP2.2 68.7,94.72 arc90 68.89,94.91 68.58,94.91 | JP12.2 79.24,94.72 arc-90 79.05,94.91 | C6.2 66.23,21.44 v66.35,21.57 | R28.1 57.48,14.09 v56.83,13.95 | R19.2 v60.95,35.22 | C5.1 v59.05,35.22 | R30.2 56.99,21.44 v56.86,21.57
  Bottom 0.635: v21.37,76.18 22,76.18 | v24.86,75.23 24.23,75.23 | v24.86,74.28 24.23,74.28 | v12.48,76.18 11.84,76.18 | v66.35,21.57 66.67,21.57 | v56.83,13.95 56.51,13.95 | v60.95,35.22 60.95,35.54 60.64,35.86 | v59.05,35.22 59.05,35.54 | v56.86,21.57 56.36,21.06
  pour Bottom: -2.06,102.85 187.93,102.85 187.93,-2.81 -2.06,-2.81
N$1
  Top 0.635: J13.10 J13.9 14.02,79.94 D1.1
N$2
  Top 0.635: J13.2 J13.1 23.5,82.55 D2.2
N$3
  Top 0.254: R13.P$2 80.91,52.07 JP1.2
N$4
  Top 0.254: R13.P$1 78.41,52.11 JP1.3
N$5
  Top 0.254: R13.P$3 83.49,52.11 JP1.1
N$6
  Top 0.254: R1.P$2 49.66,76.68 49.84,76.5 49.84,76.88 JP3.2
N$7
  Top 0.254: R1.P$1 47.16,77.15 JP3.3
N$8
  Top 0.254: R1.P$3 52.24,77.15 JP3.1
N$9
  Top 0.254: R2.P$2 74.66,77.08 JP5.2
N$10
  Top 0.254: R2.P$1 72.16,77.04 JP5.3
N$11
  Top 0.254: R2.P$3 77.24,77.04 JP5.1
N$12
  Top 0.254: R3.P$2 49.66,52.23 50.16,51.73 50.16,51.8 JP7.2
N$13
  Top 0.254: R3.P$1 47.16,52.26 JP7.3
N$14
  Top 0.254: R3.P$3 52.24,52.26 JP7.1
N$15
  Top 0.254: R4.P$2 99.66,27.19 JP9.2
N$16
  Top 0.254: R4.P$1 JP9.3
N$17
  Top 0.254: R4.P$3 102.24,26.98 101.91,26.65 101.91,26.84 JP9.1
N$18
  Top 0.254: R5.P$2 74.66,27.3 JP11.2
N$19
  Top 0.254: R5.P$1 72.16,27.26 JP11.3
N$20
  Top 0.254: R5.P$3 77.24,27.26 JP11.1
N$21
  Top 0.254: R6.P$2 99.66,76.97 JP13.2
N$22
  Top 0.254: R6.P$1 97.16,76.95 JP13.3
N$23
  Top 0.254: R6.P$3 102.24,76.95 JP13.1
N$24
  Top 0.254: R7.P$2 105.91,52.43 JP15.2
N$25
  Top 0.254: R7.P$1 103.41,52.39 JP15.3
N$26
  Top 0.254: R7.P$3 108.49,52.28 108.26,52.05 JP15.1
N$27
  Top 0.254: R8.P$2 105.91,2.39 JP17.2
N$28
  Top 0.254: R8.P$1 103.41,2.43 JP17.3
N$29
  Top 0.254: R8.P$3 108.49,2.43 JP17.1
N$30
  Top 0.254: R9.P$2 124.66,77.02 JP19.2
N$31
  Top 0.254: R9.P$1 122.16,77.06 JP19.3
N$32
  Top 0.254: R9.P$3 127.24,77.06 JP19.1
N$33
  Top 0.254: R10.P$2 130.91,52.33 JP21.2
N$34
  Top 0.254: R10.P$1 128.41,52.29 JP21.3
N$35
  Top 0.254: R10.P$3 133.49,52.29 JP21.1
N$36
  Top 0.254: R11.P$2 130.91,2.54 JP23.2
N$37
  Top 0.254: R11.P$1 128.41,2.5 JP23.3
N$38
  Top 0.254: R11.P$3 133.49,2.5 JP23.1
N$39
  Top 0.254: R12.P$2 155.91,26.67 155.89,26.65 155.89,26.97 JP25.2
N$40
  Top 0.254: R12.P$1 153.41,27.29 JP25.3
N$41
  Top 0.254: R12.P$3 158.49,27.29 JP25.1
N$42
  Top 0.254: R14.P$2 124.66,27.24 JP27.2
N$43
  Top 0.254: R14.P$1 122.16,27.28 JP27.3
N$44
  Top 0.254: R14.P$3 127.24,27.28 JP27.1
N$45
  Top 0.254: R15.P$2 155.91,2.43 JP29.2
N$46
  Top 0.254: R15.P$1 153.41,2.39 JP29.3
N$47
  Top 0.254: R15.P$3 158.49,2.39 JP29.1
N$48
  Top 0.254: R16.P$2 155.91,52.22 JP31.2
N$49
  Top 0.254: R16.P$1 153.41,52.18 JP31.3
N$50
  Top 0.254: R16.P$3 158.49,52.18 JP31.1
N$51
  Top 0.254: R17.P$2 155.91,77.11 JP33.2
N$52
  Top 0.254: R17.P$1 153.41,77.07 JP33.3
N$53
  Top 0.254: R17.P$3 158.49,76.24 158.43,76.18 158.43,76.75 JP33.1
N$54
  Top 0.254: R18.P$2 80.91,2.47 JP35.2
N$55
  Top 0.254: R18.P$1 78.41,2.5 JP35.3
N$56
  Top 0.254: R18.P$3 83.49,2.5 JP35.1
N$58
  Top 0.254: J1.SWITCH_B@1 12.23,96.5 15.34,96.5 15.97,95.87 20.41,95.87 21.55,97 JP37.2
N$59  (via drill 0.3)
  Top 0.254: v18.51,94.59 18.51,93.64 24.23,87.93 25.81,87.93 27.79,89.9 JP38.1
  Bottom 0.254: J2.TIP_B@1 18.51,98.28 v18.51,94.59
N$60
  Top 0.254: J2.SWITCH_B@1 25.23,90.75 JP38.2
N$61
  Top 0.254: J3.TIP_B@1 18.41,68.78 15.34,65.7 15.34,63.16 16.61,61.89 18.56,61.89 JP39.1
N$62
  Top 0.254: J3.SWITCH_B@1 22.11,62.18 JP39.2
N$64
  Top 0.254: J4.SWITCH_B@1 9.61,66.98 12.48,64.11 12.48,61.72 JP40.2
N$66
  Top 0.254: JP41.2 11.65,45.92 J5.SWITCH_B@1
N$67
  Top 0.254: JP42.1 20.8,50.76 J6.TIP_B@1
N$68
  Top 0.254: JP42.2 23.34,45.1 J6.SWITCH_B@1
N$70
  Top 0.254: JP43.2 11.65,20.92 J7.SWITCH_B@1
N$71
  Top 0.254: JP44.1 19.27,24.24 J8.TIP_B@1
N$72
  Top 0.254: JP44.2 21.81,19.22 22.64,18.39 22.59,18.39 J8.SWITCH_B@1
N$73
  Top 0.254: IC1.3 R19.1
N$74
  Top 0.254: J9.SWITCH_B@1 178.36,10.94 175.35,13.95 170.04,13.95 JP45.2
N$75
  Top 0.254: IC1.5 58.67,24.69 57.78,23.79 R30.1
N$76
  Top 0.254: J10.SWITCH_B@1 178.36,36.34 176.62,38.08 170.7,38.08 JP46.2
N$77
  Top 0.254: D3.+ 29.05,94.34 29.94,95.23 R31.2
N$78
  Top 0.254: 178.43,56.44 J11.SWITCH_B@1 178.36,61.11 175.99,63.48 170.91,63.48 170.13,64.26 JP47.2
N$79
  Top 0.254: D4.+ 26.52,65.64 R32.2
N$80
  Top 0.254: 178.43,81.44 J12.SWITCH_B@1 178.36,86.51 175.99,88.88 169.97,88.88 JP48.2
N$81
  Top 0.254: D5.+ 26.52,47.67 R33.2
N$82
  Top 0.254: R34.2 26.26,19.13 D6.+
N$84
  Top 0.254: R21.2 R22.2 R23.2 R24.2 62.73,36.83 R20.1 C7.1 62.22,31.86 IC1.2 62.22,28.45 61.44,27.67 57.37,27.67 52.29,22.59 42.64,22.59 41.12,21.06 | 41.12,21.06 37.05,17 R35.2 | R36.2 49.75,16.49 47.72,18.52 43.66,18.52 41.12,21.06
N$85
  Top 0.254: R28.2 60.77,14.09 U$13.ANODE 62.53,13.95 63.81,13.95 64.77,14.91 U$12.CATHODE
N$86
  Top 0.254: R20.2 C7.2 63.5,31.6 IC1.1 63.5,27.92 62.22,26.65 57.88,26.65 52.24,21.01 R29.P$3
N$87
  Top 0.254: IC1.6 60.95,22.33 C8.1 60.83,20.94 R26.1 59.86,20.43 R25.2
N$88
  Top 0.254: IC1.7 62.22,22.33 C8.2 62.35,20.94 R27.1
N$89
  Top 0.254: R26.2 R27.2 65.84,18.9 67.62,17.12 67.62,13.63 64.86,10.88 J14.TIP_B@1
N$90
  Top 0.254: U$12.ANODE 66.05,17.11 65.4,17.76 63.18,17.76 U$13.CATHODE 59.21,16.81 R25.1 52.88,17.53 R29.P$2
RS
  Top 0.254: J10.TIP_B@1 168.03,35.88 167.1,36.81 | 167.1,36.81 167.1,39.14 JP46.1 | 167.1,36.81 164.24,33.95 68.89,33.95 67.53,35.31 67.53,37.83 66.47,38.89 R23.1
RSTRIG
  Top 0.254: J5.TIP_B@1 8.57,51.03 JP41.1 9.11,52.56 11.14,54.59 23.84,54.59 26.26,52.18 R33.1
SD
  Top 0.254: R22.1 64.45,40.94 66.03,40.94 67.94,42.84 67.94,47.61 79.37,59.03 160.75,59.03 165.97,64.26 JP47.1 167.1,64.09 167.1,62.84 169.07,60.88 J11.TIP_B@1
SDTRIG
  Top 0.254: J4.TIP_B@1 5.91,68.78 10.26,64.43 10.26,61.66 JP40.1 10.13,60.18 12.16,58.15 22.83,58.15 26.38,61.7 R32.1
X1
  Top 0.254: R35.1 37.05,10.98 J15.TIP_B@1
X2
  Top 0.254: R36.1 49.75,10.97 J16.TIP_B@1